# EAGLE design steering_wheel_V3.1 (EAGLE 8.1.0)

## Sheet 1 of 4
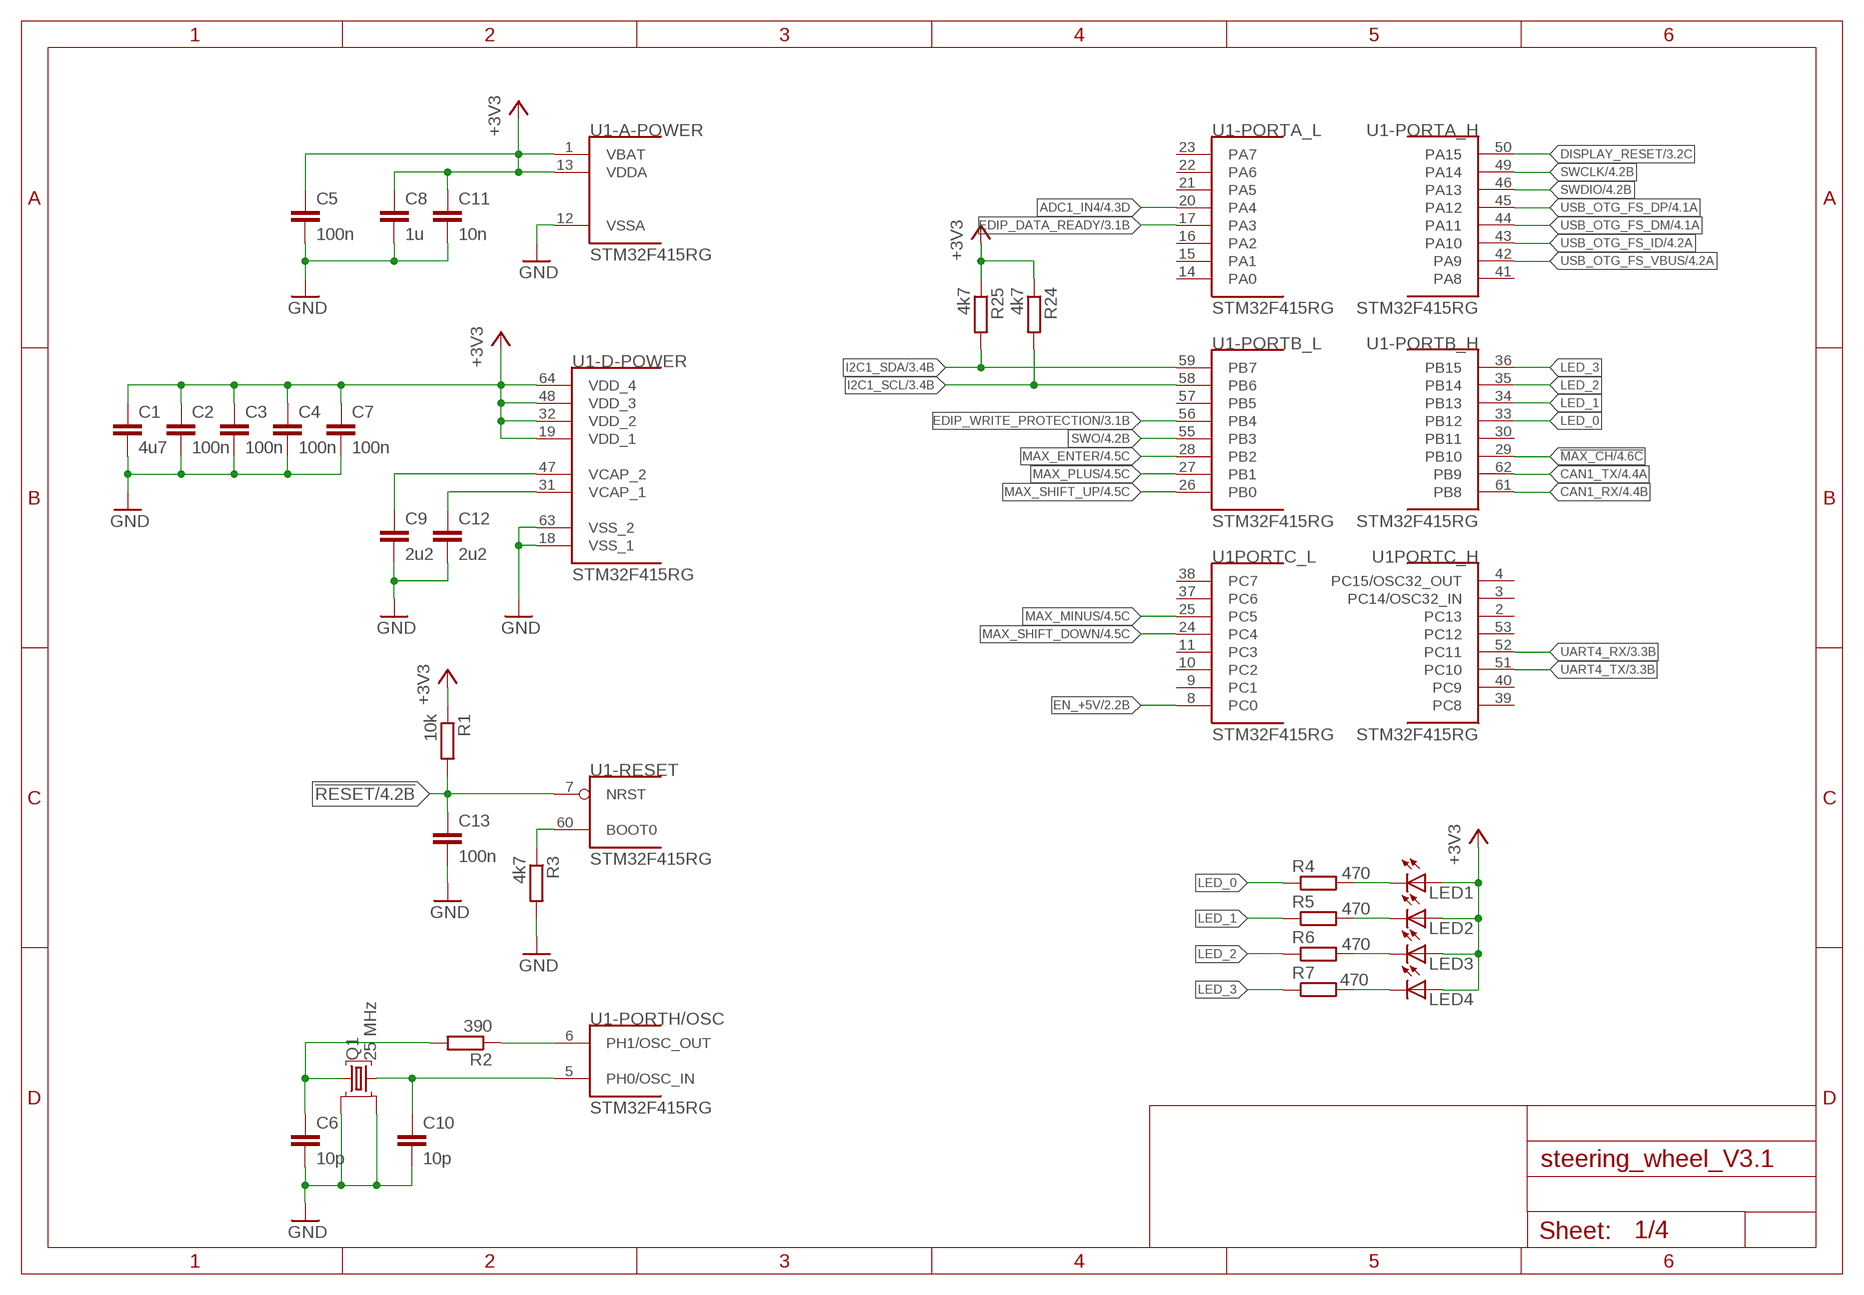
[diagram p0: schematic, sheet 1]

### Parts
C1  4u7  C-EUC0603  [C0603]
C2  100n  C-EUC0603  [C0603]
C3  100n  C-EUC0603  [C0603]
C4  100n  C-EUC0603  [C0603]
C5  100n  C-EUC0603  [C0603]
C6  10p  C-EUC0603  [C0603]
C7  100n  C-EUC0603  [C0603]
C8  1u  C-EUC0603  [C0603]
C9  2u2  C-EUC0603  [C0603]
C10  10p  C-EUC0603  [C0603]
C11  10n  C-EUC0603  [C0603]
C12  2u2  C-EUC0603  [C0603]
C13  100n  C-EUC0603  [C0603]
LED1  LEDCHIPLED_0603  [CHIPLED_0603]
LED2  LEDCHIPLED_0603  [CHIPLED_0603]
LED3  LEDCHIPLED_0603  [CHIPLED_0603]
LED4  LEDCHIPLED_0603  [CHIPLED_0603]
Q1  25 MHz  CRYSTAL2M_CX32  [3.2X2.5MM-SMD]
R1  10k  R-EU_R0603  [R0603]
R2  390  R-EU_R0603  [R0603]
R3  4k7  R-EU_R0603  [R0603]
R4  470  R-EU_R0603  [R0603]
R5  470  R-EU_R0603  [R0603]
R6  470  R-EU_R0603  [R0603]
R7  470  R-EU_R0603  [R0603]
R24  4k7  R-EU_R0603  [R0603]
R25  4k7  R-EU_R0603  [R0603]
U1  STM32F415RG  [LQFP64]

### Nets
!MAX_CH: U1.29(-PORTB_H:PB10) ; also sheet 4
!RESET: C13.1 R1.2 U1.7(-RESET:NRST) ; also sheet 4
+3V3: C1.1 C2.1 C3.1 C4.1 C5.1 C7.1 C8.1 C11.1 LED1.A LED2.A LED3.A LED4.A R1.1 R24.1 R25.1 U1.1(-A-POWER:VBAT) U1.13(-A-POWER:VDDA) U1.19(-D-POWER:VDD_1) U1.32(-D-POWER:VDD_2) U1.48(-D-POWER:VDD_3) U1.64(-D-POWER:VDD_4) ; also sheet 2,3,4
ADC1_IN4: U1.20(-PORTA_L:PA4) ; also sheet 4
CAN1_RX: U1.61(-PORTB_H:PB8) ; also sheet 4
CAN1_TX: U1.62(-PORTB_H:PB9) ; also sheet 4
DISPLAY_RESET: U1.50(-PORTA_H:PA15) ; also sheet 3
EDIP_DATA_READY: U1.17(-PORTA_L:PA3) ; also sheet 3
EDIP_WRITE_PROTECTION: U1.56(-PORTB_L:PB4) ; also sheet 3
EN_+5V: U1.8(PORTC_L:PC0) ; also sheet 2
GND: C1.2 C2.2 C3.2 C4.2 C5.2 C6.2 C7.2 C8.2 C9.2 C10.2 C11.2 C12.2 C13.2 Q1.2(GND1) Q1.4(GND2) R3.2 U1.12(-A-POWER:VSSA) U1.18(-D-POWER:VSS_1) U1.63(-D-POWER:VSS_2) ; also sheet 2,3,4
I2C1_SCL: R24.2 U1.58(-PORTB_L:PB6) ; also sheet 3
I2C1_SDA: R25.2 U1.59(-PORTB_L:PB7) ; also sheet 3
LED_0: R4.1 U1.33(-PORTB_H:PB12)
LED_1: R5.1 U1.34(-PORTB_H:PB13)
LED_2: R6.1 U1.35(-PORTB_H:PB14)
LED_3: R7.1 U1.36(-PORTB_H:PB15)
MAX_ENTER: U1.28(-PORTB_L:PB2) ; also sheet 4
MAX_MINUS: U1.25(PORTC_L:PC5) ; also sheet 4
MAX_PLUS: U1.27(-PORTB_L:PB1) ; also sheet 4
MAX_SHIFT_DOWN: U1.24(PORTC_L:PC4) ; also sheet 4
MAX_SHIFT_UP: U1.26(-PORTB_L:PB0) ; also sheet 4
N$1: C9.1 U1.47(-D-POWER:VCAP_2)
N$2: C12.1 U1.31(-D-POWER:VCAP_1)
N$3: R2.1 U1.6(-PORTH/OSC:PH1/OSC_OUT)
N$4: C10.1 Q1.3(Q2) U1.5(-PORTH/OSC:PH0/OSC_IN)
N$5: LED4.C R7.2
N$6: R3.1 U1.60(-RESET:BOOT0)
N$11: LED2.C R5.2
N$12: LED3.C R6.2
N$24: C6.1 Q1.1(Q1) R2.2
N$27: LED1.C R4.2
SWCLK: U1.49(-PORTA_H:PA14) ; also sheet 4
SWDIO: U1.46(-PORTA_H:PA13) ; also sheet 4
SWO: U1.55(-PORTB_L:PB3) ; also sheet 4
UART4_RX: U1.52(PORTC_H:PC11) ; also sheet 3
UART4_TX: U1.51(PORTC_H:PC10) ; also sheet 3
USB_OTG_FS_DM: U1.44(-PORTA_H:PA11) ; also sheet 4
USB_OTG_FS_DP: U1.45(-PORTA_H:PA12) ; also sheet 4
USB_OTG_FS_ID: U1.43(-PORTA_H:PA10) ; also sheet 4
USB_OTG_FS_VBUS: U1.42(-PORTA_H:PA9) ; also sheet 4
Unconnected: U1.2(PORTC_H:PC13) U1.3(PORTC_H:PC14/OSC32_IN) U1.4(PORTC_H:PC15/OSC32_OUT) U1.9(PORTC_L:PC1) U1.10(PORTC_L:PC2) U1.11(PORTC_L:PC3) U1.14(-PORTA_L:PA0) U1.15(-PORTA_L:PA1) U1.16(-PORTA_L:PA2) U1.21(-PORTA_L:PA5) U1.22(-PORTA_L:PA6) U1.23(-PORTA_L:PA7) U1.30(-PORTB_H:PB11) U1.37(PORTC_L:PC6) U1.38(PORTC_L:PC7) U1.39(PORTC_H:PC8) U1.40(PORTC_H:PC9) U1.41(-PORTA_H:PA8) U1.53(PORTC_H:PC12) U1.54(-PORTD:PD2) U1.57(-PORTB_L:PB5)

## Sheet 2 of 4
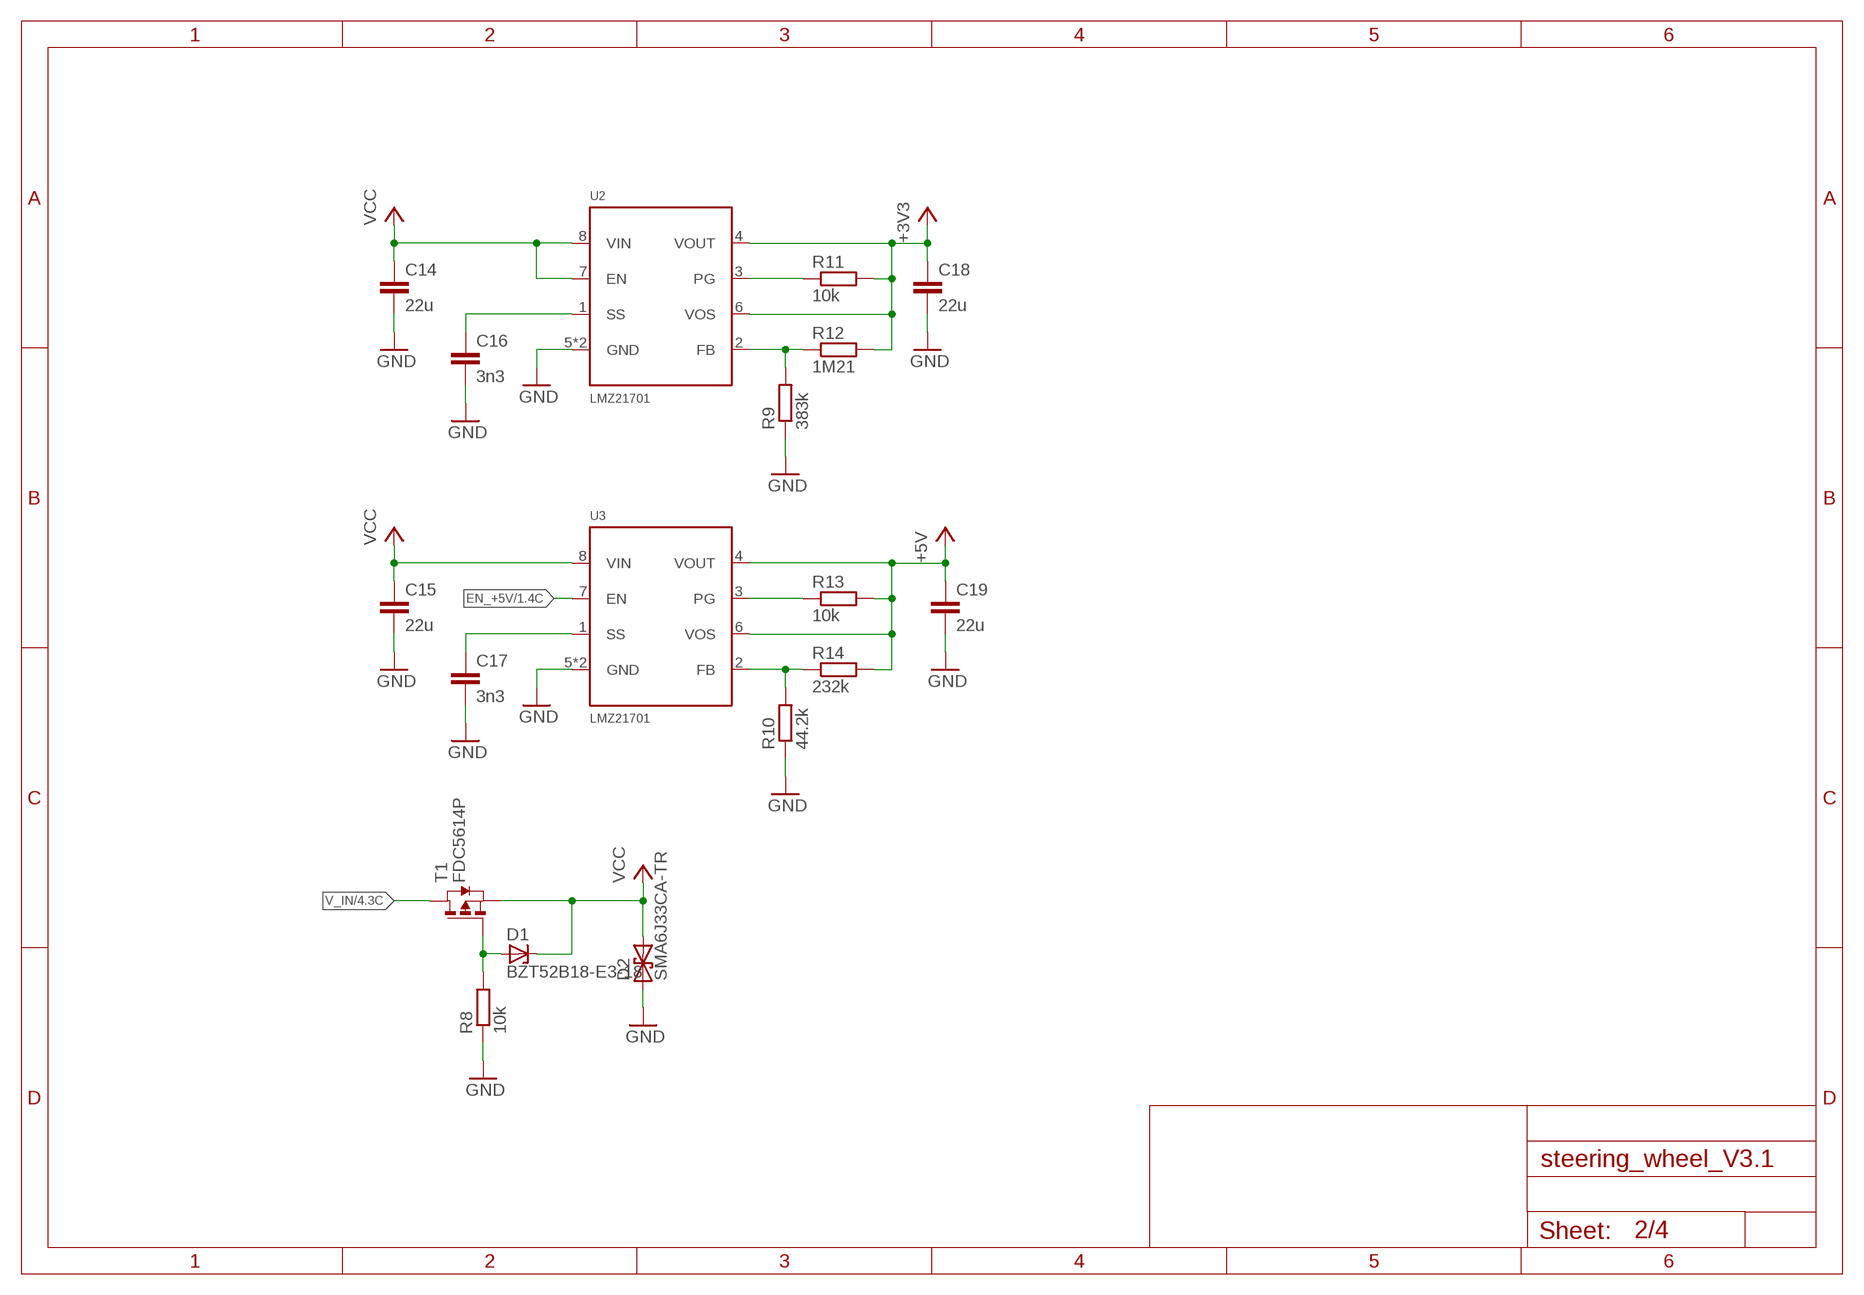
[diagram p1: schematic, sheet 2]

### Parts
C14  22u  C-EUC1210  [C1210]
C15  22u  C-EUC1210  [C1210]
C16  3n3  C-EUC0603  [C0603]
C17  3n3  C-EUC0603  [C0603]
C18  22u  C-EUC1210  [C1210]
C19  22u  C-EUC1210  [C1210]
D1  BZT52B18-E3-18  ZENER_SOD123  [SOD123F]
D2  SMA6J33CA-TR  [DO214AC]
R8  10k  R-EU_R0603  [R0603]
R9  383k  R-EU_R0603  [R0603]
R10  44.2k  R-EU_R0603  [R0603]
R11  10k  R-EU_R0603  [R0603]
R12  1M21  R-EU_R0603  [R0603]
R13  10k  R-EU_R0603  [R0603]
R14  232k  R-EU_R0603  [R0603]
T1  FDC5614P  [SSOT6]
U2  LMZ21701  [SIL0008E]
U3  LMZ21701  [SIL0008E]

### Nets
+3V3: C18.1 R11.2 R12.2 U2.4(VOUT) U2.6(VOS) ; also sheet 1,3,4
+5V: C19.1 R13.2 R14.2 U3.4(VOUT) U3.6(VOS) ; also sheet 4
EN_+5V: U3.7(EN) ; also sheet 1
GND: C14.2 C15.2 C16.2 C17.2 C18.2 C19.2 D2.A R8.1 R9.1 R10.1 U2.5(GND) U2.PAD(GND) U3.5(GND) U3.PAD(GND) ; also sheet 1,3,4
N$14: D1.A R8.2 T1.3(G)
N$38: C16.1 U2.1(SS)
N$39: C17.1 U3.1(SS)
N$40: R13.1 U3.3(PG)
N$41: R11.1 U2.3(PG)
N$42: R9.2 R12.1 U2.2(FB)
N$43: R10.2 R14.1 U3.2(FB)
V_IN: T1.1(D) T1.2(D) T1.5(D) T1.6(D) ; also sheet 4
VCC: C14.1 C15.1 D1.C D2.C T1.4(S) U2.7(EN) U2.8(VIN) U3.8(VIN)

## Sheet 3 of 4
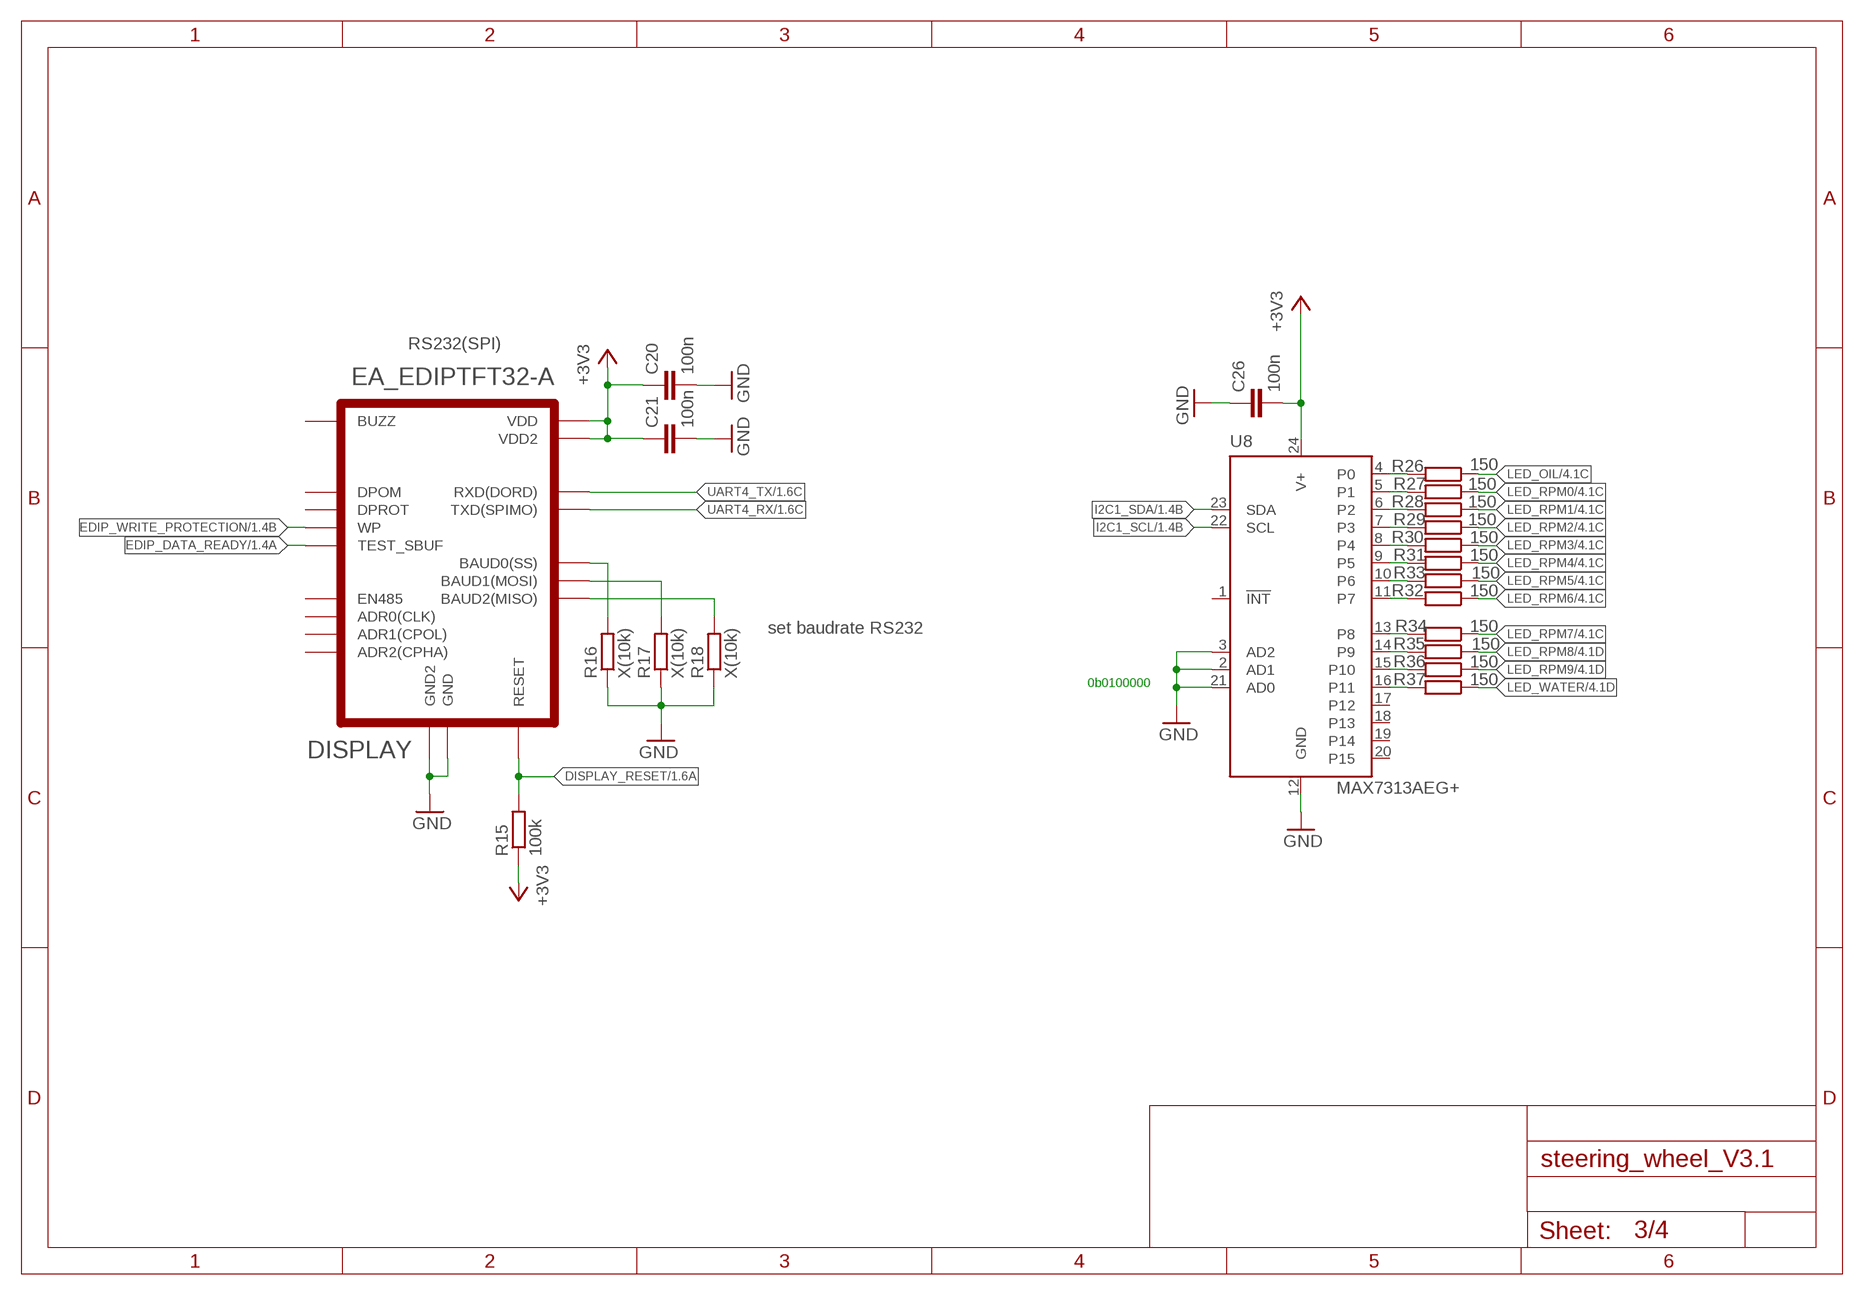
[diagram p2: schematic, sheet 3]

### Parts
C20  100n  C-EUC0603  [C0603]
C21  100n  C-EUC0603  [C0603]
C26  100n  C-EUC0603  [C0603]
DISPLAY  EA_EDIPTFT32-A  EA_EDIPTFT32-A-SR232  [EDIPTFT32-A]
R15  100k  R-EU_R0603  [R0603]
R16  X(10k)  R-EU_R0603  [R0603]
R17  X(10k)  R-EU_R0603  [R0603]
R18  X(10k)  R-EU_R0603  [R0603]
R26  150  R-EU_R0603  [R0603]
R27  150  R-EU_R0603  [R0603]
R28  150  R-EU_R0603  [R0603]
R29  150  R-EU_R0603  [R0603]
R30  150  R-EU_R0603  [R0603]
R31  150  R-EU_R0603  [R0603]
R32  150  R-EU_R0603  [R0603]
R33  150  R-EU_R0603  [R0603]
R34  150  R-EU_R0603  [R0603]
R35  150  R-EU_R0603  [R0603]
R36  150  R-EU_R0603  [R0603]
R37  150  R-EU_R0603  [R0603]
U8  MAX7313AEG+  [QSOP-24]

### Nets
+3V3: C20.1 C21.1 C26.2 DISPLAY.P$2(VDD) DISPLAY.P$22(VDD2) R15.1 U8.24(V+) ; also sheet 1,2,4
DISPLAY_RESET: DISPLAY.P$5(RESET) R15.2 ; also sheet 1
EDIP_DATA_READY: DISPLAY.P$20(TEST_SBUF) ; also sheet 1
EDIP_WRITE_PROTECTION: DISPLAY.P$19(WP) ; also sheet 1
GND: C20.2 C21.2 C26.1 DISPLAY.P$1(GND) DISPLAY.P$21(GND2) R16.1 R17.1 R18.1 U8.2(AD1) U8.3(AD2) U8.12(GND) U8.21(AD0) ; also sheet 1,2,4
I2C1_SCL: U8.22(SCL) ; also sheet 1
I2C1_SDA: U8.23(SDA) ; also sheet 1
LED_OIL: R26.1 ; also sheet 4
LED_RPM0: R27.1 ; also sheet 4
LED_RPM1: R28.1 ; also sheet 4
LED_RPM2: R29.1 ; also sheet 4
LED_RPM3: R30.1 ; also sheet 4
LED_RPM4: R31.1 ; also sheet 4
LED_RPM5: R33.1 ; also sheet 4
LED_RPM6: R32.1 ; also sheet 4
LED_RPM7: R34.1 ; also sheet 4
LED_RPM8: R35.1 ; also sheet 4
LED_RPM9: R36.1 ; also sheet 4
LED_WATER: R37.1 ; also sheet 4
N$7: R26.2 U8.4(P0)
N$8: DISPLAY.P$8(BAUD2(MISO)) R18.2
N$9: R27.2 U8.5(P1)
N$10: DISPLAY.P$7(BAUD1(MOSI)) R17.2
N$13: DISPLAY.P$6(BAUD0(SS)) R16.2
N$15: R28.2 U8.6(P2)
N$16: R29.2 U8.7(P3)
N$17: R30.2 U8.8(P4)
N$18: R31.2 U8.9(P5)
N$19: R32.2 U8.11(P7)
N$20: R33.2 U8.10(P6)
N$21: R34.2 U8.13(P8)
N$22: R35.2 U8.14(P9)
N$23: R36.2 U8.15(P10)
N$25: R37.2 U8.16(P11)
UART4_RX: DISPLAY.P$11(TXD(SPIMO)) ; also sheet 1
UART4_TX: DISPLAY.P$10(RXD(DORD)) ; also sheet 1
Unconnected: DISPLAY.P$9(ADR0(CLK)) DISPLAY.P$12(EN485) DISPLAY.P$13(DPOM) DISPLAY.P$14(ADR1(CPOL)) DISPLAY.P$15(ADR2(CPHA)) DISPLAY.P$16(BUZZ) DISPLAY.P$17(DPROT) U8.1(!INT) U8.17(P12) U8.18(P13) U8.19(P14) U8.20(P15)

### Notes on the sheet
- set baudrate RS232
- 0b0100000

## Sheet 4 of 4
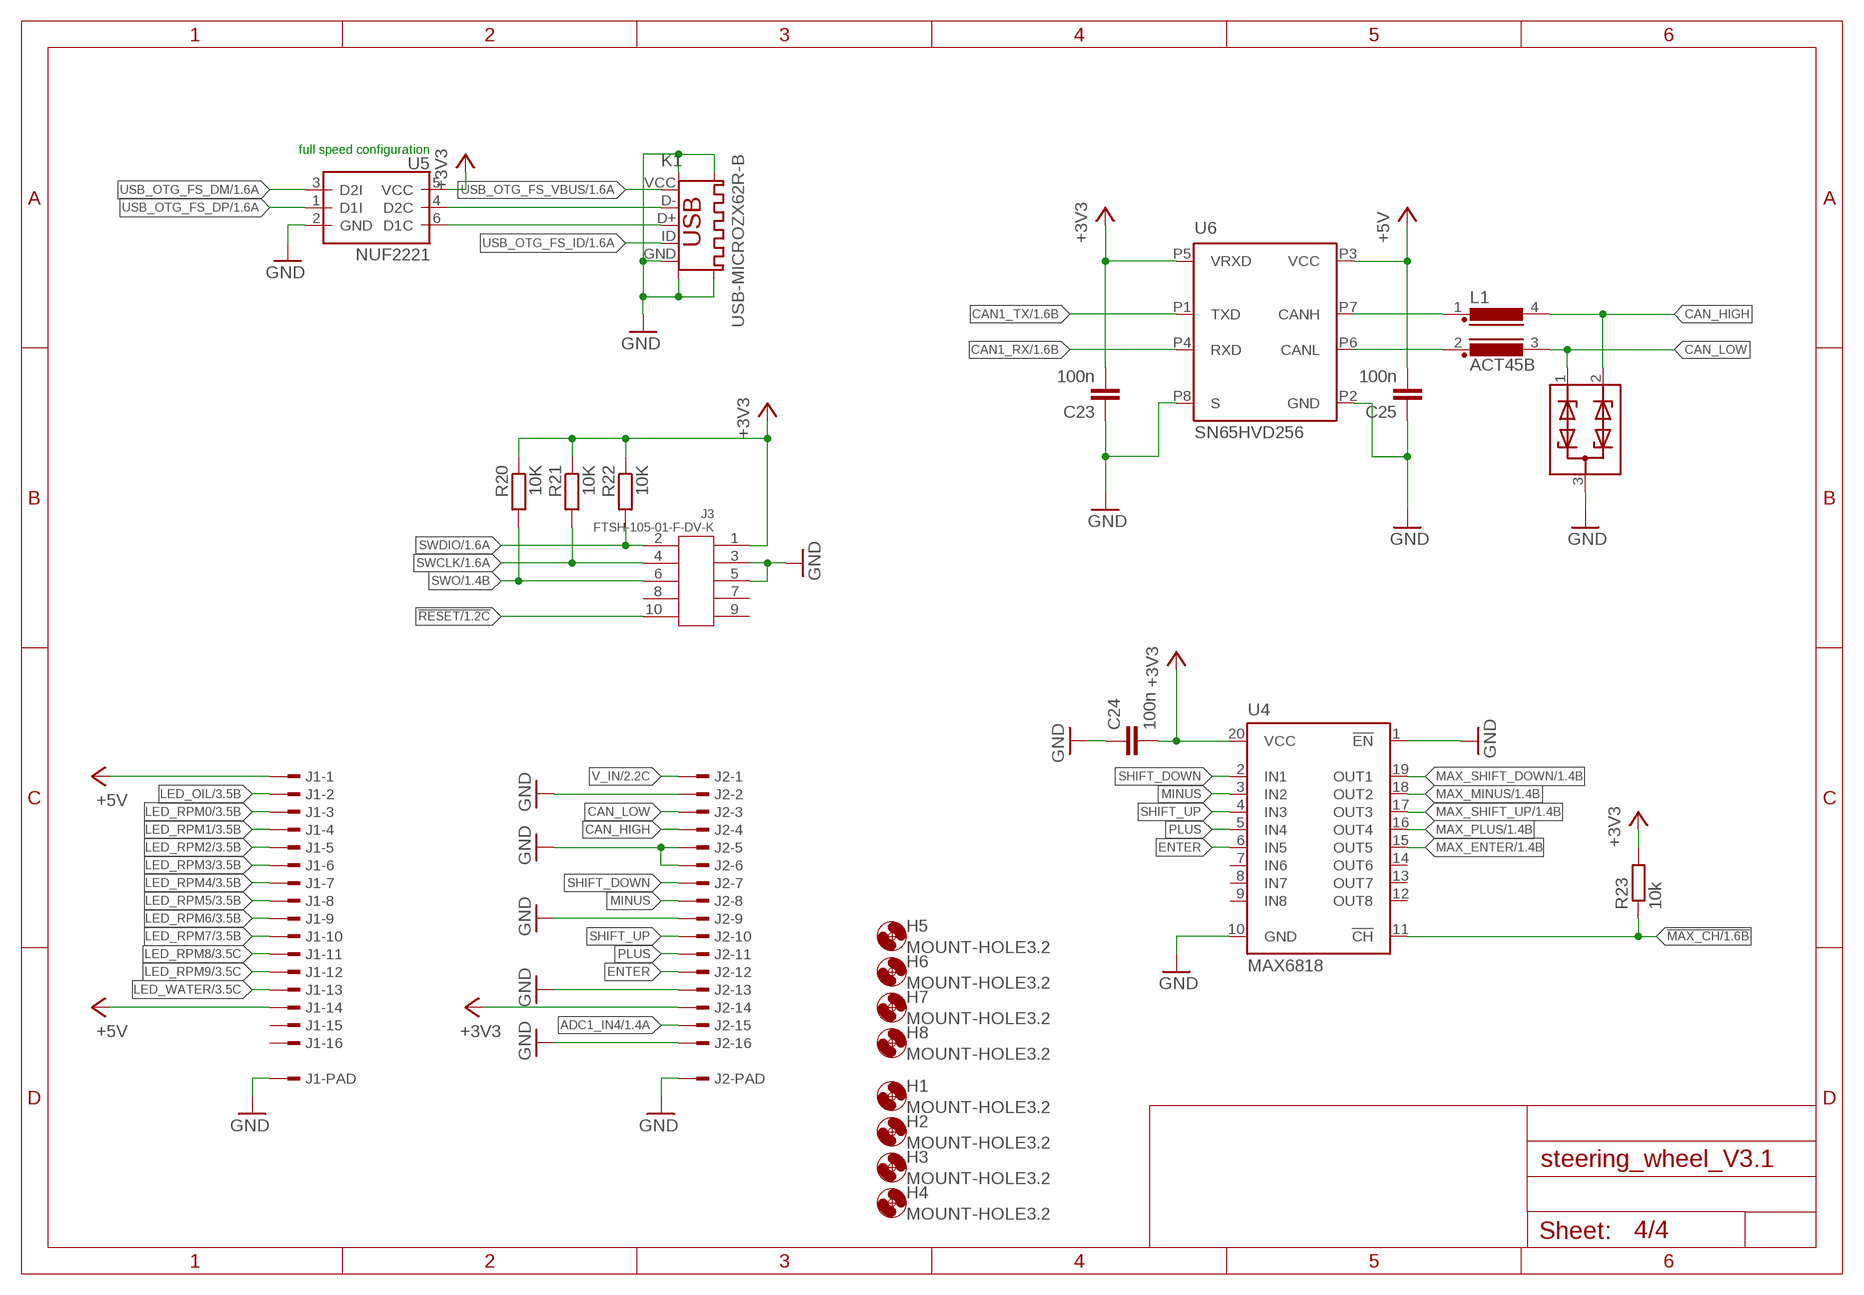
[diagram p3: schematic, sheet 4]

### Parts
C23  100n  C-EUC0603  [C0603]
C24  100n  C-EUC0603  [C0603]
C25  100n  C-EUC0603  [C0603]
D3  PESD1CAN-U  [SOT-323]
H1  MOUNT-HOLE3.2  [3,2]
H2  MOUNT-HOLE3.2  [3,2]
H3  MOUNT-HOLE3.2  [3,2]
H4  MOUNT-HOLE3.2  [3,2]
H5  MOUNT-HOLE3.2  [3,2]
H6  MOUNT-HOLE3.2  [3,2]
H7  MOUNT-HOLE3.2  [3,2]
H8  MOUNT-HOLE3.2  [3,2]
J1  1-292227-6  [1-292227-6]
J2  1-292227-6  [1-292227-6]
J3  FTSH-105-01-F-DV-K  [FTSH-105-01-XXX-DV-K]
K1  USB-MICROZX62R-B  [ZX62R-B]
L1  ACT45B  [ACT45B]
R20  10K  R-EU_R0603  [R0603]
R21  10K  R-EU_R0603  [R0603]
R22  10K  R-EU_R0603  [R0603]
R23  10k  R-EU_R0603  [R0603]
U4  MAX6818  [SSOP-20]
U5  NUF2221  [SOT363]
U6  SN65HVD256  [SOIC8]

### Nets
!MAX_CH: R23.1 U4.11(!CH) ; also sheet 1
!RESET: J3.10 ; also sheet 1
+3V3: C23.2 C24.2 J2.14 J3.1 R20.1 R21.1 R22.1 R23.2 U4.20(VCC) U5.5(VCC) U6.P5(VRXD) ; also sheet 1,2,3
+5V: C25.2 J1.1 J1.14 U6.P3(VCC) ; also sheet 2
ADC1_IN4: J2.15 ; also sheet 1
CAN1_RX: U6.P4(RXD) ; also sheet 1
CAN1_TX: U6.P1(TXD) ; also sheet 1
CAN_HIGH: D3.2 J2.4 L1.4
CAN_LOW: D3.1 J2.3 L1.3
ENTER: J2.12 U4.6(IN5)
GND: C23.1 C24.1 C25.1 D3.3 J1.PAD1 J1.PAD2 J2.2 J2.5 J2.6 J2.9 J2.13 J2.16 J2.PAD1 J2.PAD2 J3.3 J3.5 K1.GND K1.P$6(GND3) K1.P$7(GND4) K1.P$8(GND1) K1.P$9(GND2) U4.1(!EN) U4.10(GND) U5.2(GND) U6.P2(GND) U6.P8(S) ; also sheet 1,2,3
LED_OIL: J1.2 ; also sheet 3
LED_RPM0: J1.3 ; also sheet 3
LED_RPM1: J1.4 ; also sheet 3
LED_RPM2: J1.5 ; also sheet 3
LED_RPM3: J1.6 ; also sheet 3
LED_RPM4: J1.7 ; also sheet 3
LED_RPM5: J1.8 ; also sheet 3
LED_RPM6: J1.9 ; also sheet 3
LED_RPM7: J1.10 ; also sheet 3
LED_RPM8: J1.11 ; also sheet 3
LED_RPM9: J1.12 ; also sheet 3
LED_WATER: J1.13 ; also sheet 3
MAX_ENTER: U4.15(OUT5) ; also sheet 1
MAX_MINUS: U4.18(OUT2) ; also sheet 1
MAX_PLUS: U4.16(OUT4) ; also sheet 1
MAX_SHIFT_DOWN: U4.19(OUT1) ; also sheet 1
MAX_SHIFT_UP: U4.17(OUT3) ; also sheet 1
MINUS: J2.8 U4.3(IN2)
N$47: L1.1 U6.P7(CANH)
N$66: L1.2 U6.P6(CANL)
PLUS: J2.11 U4.5(IN4)
SHIFT_DOWN: J2.7 U4.2(IN1)
SHIFT_UP: J2.10 U4.4(IN3)
SWCLK: J3.4 R21.2 ; also sheet 1
SWDIO: J3.2 R22.2 ; also sheet 1
SWO: J3.6 R20.2 ; also sheet 1
USB_DM: K1.D- U5.4(D2C)
USB_DP: K1.D+ U5.6(D1C)
USB_OTG_FS_DM: U5.3(D2I) ; also sheet 1
USB_OTG_FS_DP: U5.1(D1I) ; also sheet 1
USB_OTG_FS_ID: K1.ID ; also sheet 1
USB_OTG_FS_VBUS: K1.VCC ; also sheet 1
V_IN: J2.1 ; also sheet 2
Unconnected: J1.15 J1.16 J3.7 J3.8 J3.9 U4.7(IN6) U4.8(IN7) U4.9(IN8) U4.12(OUT8) U4.13(OUT7) U4.14(OUT6)

### Notes on the sheet
- full speed configuration

## Library data of the parts
C1-C5 C7-C9 C11 C12 C14-C21 C23-C26 = rcl:C-EU: CAPACITOR, European symbol
C6 C10 C13 = rcl:C-EU: CAPACITOR, European symbol; DISTRIBUTOR: Digikey; OC_DIGIKEY: 445-1769-1-ND; ORDER_CODE: 445-1769-1-ND
D1 = usr_diode:ZENER_SOD123; DISTRIBUTOR: Mouser; OC_MOUSER: 78-BZT52B18-E3-18; ORDER_CODE: 78-BZT52B18-E3-18
D2 = usr_diode:SMA6J33CA-TR; DISTRIBUTOR: Mouser; OC_MOUSER: 511-SMA6J33CA-TR; ORDER_CODE: 511-SMA6J33CA-TR
D3 = usr_nxp:PESD1CAN-U: PESD1CAN-U CAN bus ESD protection diode; DISTRIBUTOR: Digikey; OC_DIGIKEY: 568-10731-1-ND; ORDER_CODE: 568-10731-1-ND
DISPLAY = _TUG Racing Team_:EA_EDIPTFT32-A-SR232
H1-H8 = holes:MOUNT-HOLE: MOUNTING HOLE with drill center marker
J1 J2 = te:1-292227-6: 1.5mm AMP Mini CT Connectors; DISTRIBUTOR: Digikey; OC_DIGIKEY: A99782CT-ND; ORDER_CODE: A99782CT-ND
J3 = samtec:FTSH-105-01-*-DV-K
K1 = usr_hirose-electric:USB-MICRO: Micro B - Reverse (Top mount) Shell SMT Source: http://media.digikey.com/PDF/Data%20Sheets/Hirose%20PDFs/ZX62R-B-5P.pdf; DISTRIBUTOR: Digikey; OC_DIGIKEY: H11574CT-ND; ORDER_CODE: H11574CT-ND
L1 = usr_gerneral:ACT45B: EPCOS - ACT45B common-mode chokes for CAN bus systems, EIA 1812 51 μH, 200 mA; DISTRIBUTOR: Digikey; OC_DIGIKEY: 495-4597-2-ND; ORDER_CODE: 495-4597-2-ND
LED1-LED4 = led:LED: LED OSRAM: - CHIPLED LG R971, LG N971, LY N971, LG Q971, LY Q971, LO R971, LY R971 LH N974, LH R974 LS Q976, LO Q976, LY Q976 LO Q996 - Hyper CHIPLED LW Q18S LB Q993, LB Q99A, LB R99A - SideLED LS A670, LO A670, LY A670, LG A670, LP A670 LB A673, LV A673, LT A673, LW A673 LH A674 LY A675 LS A676, LA A676, LO A676, LY A676, LW A676 LS A679, LY A679, LG A679 - Hyper Micro SIDELED® LS Y876, LA Y876, LO Y876, LY Y876 LT Y87S - SmartLED LW L88C, LW L88S LB L89C, LB L89S, LG L890 LS L89K, LO L89K, LY L89K LS L896, LA L896, LO L896, LY L896 - TOPLED LS T670, LO T670, LY T670, LG T670, LP T670 LSG T670, LSP T670, LSY T670, LOP T670, LYG T670 LG T671, LOG T671, LSG T671 LB T673, LV T673, LT T673, LW T673 LH T674 LS T676, LA T676, LO T676, LY T676, LB T676, LH T676, LSB T676, LW T676 LB T67C, LV T67C, LT T67C, LS T67K, LO T67K, LY T67K, LW E67C LS E67B, LA E67B, LO E67B, LY E67B, LB E67C, LV E67C, LT E67C LW T67C LS T679, LY T679, LG T679 LS T770, LO T770, LY T770, LG T770, LP T770 LB T773, LV T773, LT T773, LW T773 LH T774 LS E675, LA E675, LY E675, LS T675 LS T776, LA T776, LO T776, LY T776, LB T776 LHGB T686 LT T68C, LB T68C - Hyper Mini TOPLED® LB M676 - Mini TOPLED Santana® LG M470 LS M47K, LO M47K, LY M47K Source: http://www.osram.convergy.de LUXEON: - LUMILED® LXK2-PW12-R00, LXK2-PW12-S00, LXK2-PW14-U00, LXK2-PW14-V00 LXK2-PM12-R00, LXK2-PM12-S00, LXK2-PM14-U00 LXK2-PE12-Q00, LXK2-PE12-R00, LXK2-PE12-S00, LXK2-PE14-T00, LXK2-PE14-U00 LXK2-PB12-K00, LXK2-PB12-L00, LXK2-PB12-M00, LXK2-PB14-N00, LXK2-PB14-P00, LXK2-PB14-Q00 LXK2-PR12-L00, LXK2-PR12-M00, LXK2-PR14-Q00, LXK2-PR14-R00 LXK2-PD12-Q00, LXK2-PD12-R00, LXK2-PD12-S00 LXK2-PH12-R00, LXK2-PH12-S00 LXK2-PL12-P00, LXK2-PL12-Q00, LXK2-PL12-R00 Source: www.luxeon.com KINGBRIGHT: KA-3528ASYC Source: www.kingbright.com; ASMT-RA45-AQ502: amber; ASMT-RF45-AQ502: green; ASMT-RJ45-AQ502: orange; ASMT-RR45-AQ502: red
Q1 = usr_crystal:CRYSTAL2M*: Crystal Source: ABM11 Series <http://www.abracon.com/Resonators/ABM11.pdf>; DISTRIBUTOR: Digikey; OC_DIGIKEY: 644-1266-1-ND; ORDER_CODE: 644-1266-1-ND
R1-R3 R9 R11-R13 R24-R37 = rcl:R-EU_: RESISTOR, European symbol; DISTRIBUTOR: Digikey; OC_DIGIKEY: P390AGCT-ND; ORDER_CODE: P390AGCT-ND
R4-R7 R10 R14-R18 R23 = rcl:R-EU_: RESISTOR, European symbol
R8 R20-R22 = rcl:R-EU_: RESISTOR, European symbol; DISTRIBUTOR: Mouser; OC_MOUSER: 71-CRCW0402-10K-E3; ORDER_CODE: 71-CRCW0402-10K-E3
T1 = usr_gerneral:FDC5614P: 60V P-Channel MOSFET Id -3A Vds -60V Vgs -20V; DISTRIBUTOR: Mouser; OC_MOUSER: 512-FDC5614P; ORDER_CODE: 512-FDC5614P
U1 = STMicroelectronics:STM32F415RG; DISTRIBUTOR: Digikey; OC_DIGIKEY: 497-11767-ND; ORDER_CODE: 497-11767-ND
U2 U3 = ti:LMZ2170*: LMZ2170X 1 A SIMPLE SWITCHER® Nano Module with 17 V Maximum Input Voltage; DISTRIBUTOR: RS; ORDER_CODE: 798-1212
U4 = maxim:MAX6818: ±15kV ESD-Protected Octal CMOS Switch Debouncers
U5 = usr_on-semiconductor:NUF2221: USB Upstream Terminator with ESD Protection http://www.onsemi.com/pub_link/Collateral/NUF2221W1T2-D.PDF; DISTRIBUTOR: Digikey; OC_DIGIKEY: NUF2221W1T2GOSCT-ND; ORDER_CODE: NUF2221W1T2GOSCT-ND
U6 = usr_TexasInstruments:SN65HVD256: SN65HVD256 - CAN Transceiver With Fast Loop Times for Highly Loaded Networks has logic and output power supplies!; DISTRIBUTOR: Digikey; OC_DIGIKEY: 296-30093-1-ND; ORDER_CODE: 296-30093-1-ND
U8 = maxim:MAX7313: 16-Port I/O Expander with LED Intensity Control, Interrupt, and Hot-Insertion Protection

## Board
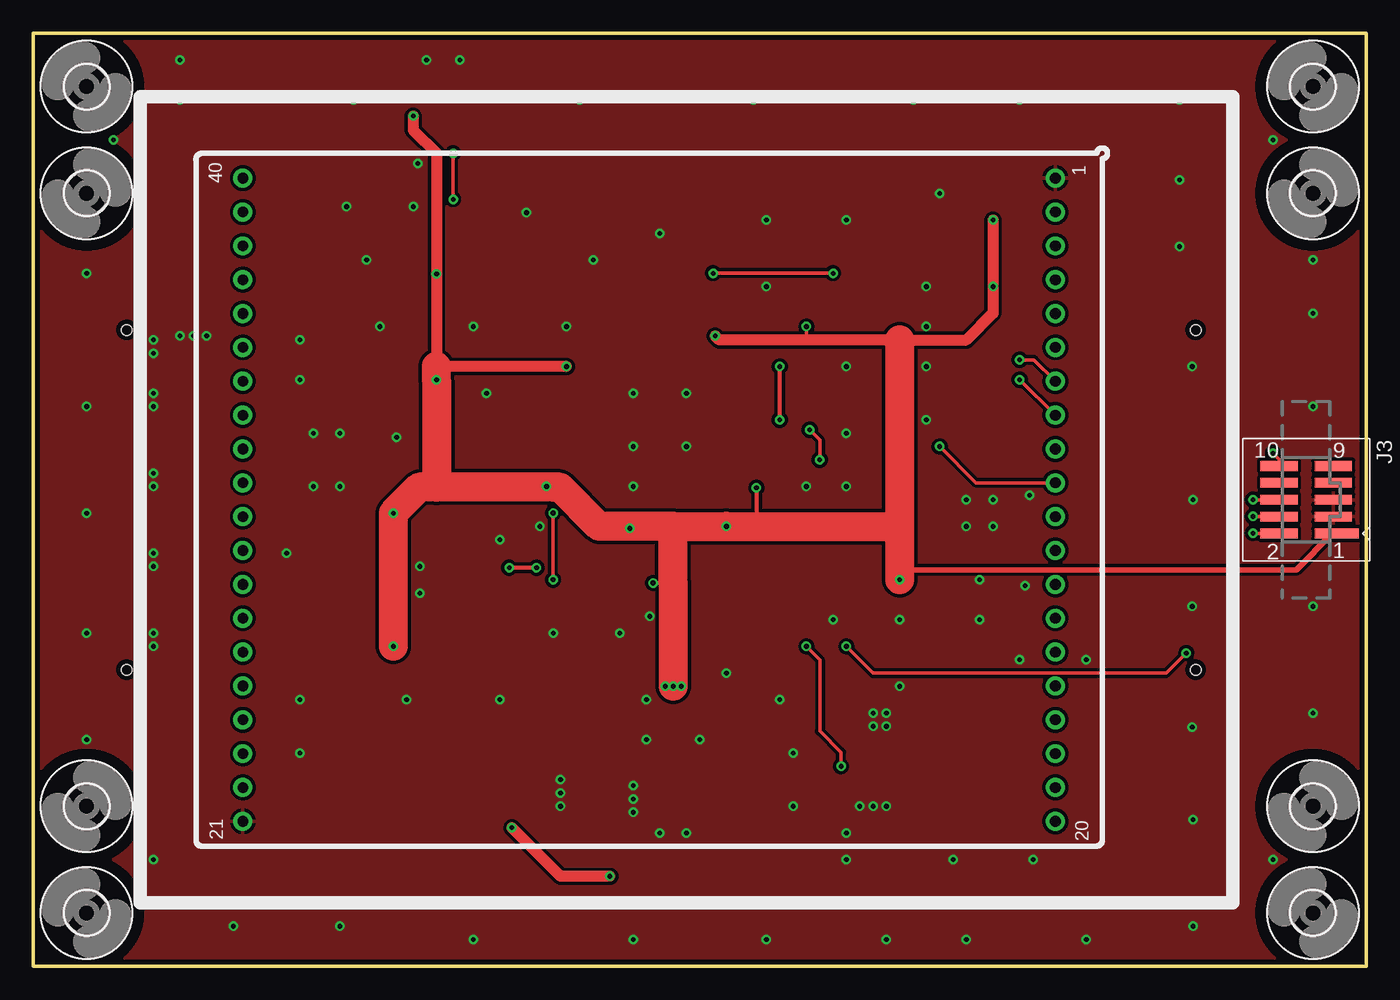
[diagram p4: board, top side]
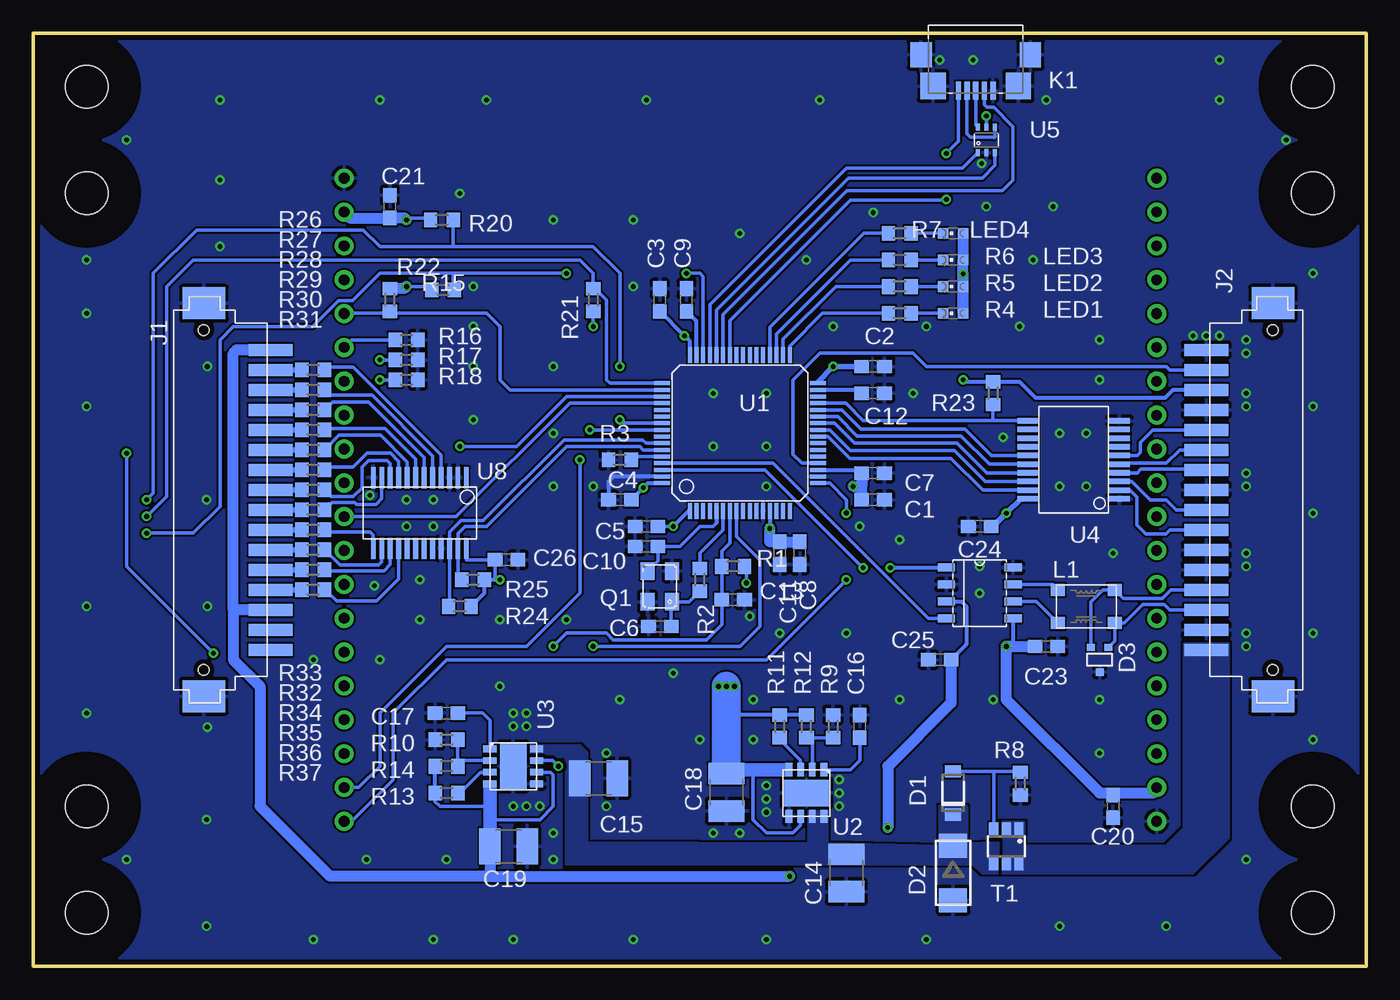
[diagram p5: board, bottom side, seen from below]

Size 100 x 70 mm. Coordinates in mm from the lower left corner, seen from the top.
Outline: 0,70 0,0 100,0 100,70 0,70
Copper layers (1*16): Top 0.0356mm / dielectric 1.5011mm / Bottom 0.0356mm
Design rules "oshPark2Layer": minimum track width 6mil, minimum drill 13mil, track to track 6mil, track to pad 6mil, pad to pad 6mil, via to via 6mil, smd to smd 6mil, copper to edge 15mil, drill to drill 6mil, minimum pad ring 7mil, minimum via ring 7mil, stop-mask expansion 3mil, vias tented up to drill 0mil, thermal gap 10mil
tKeepout: area 9,6 to 89,64

### Footprints (pad centres in the part's own frame; a part is rotated, then mirrored left to right if it is on the bottom)
C0603 = smd 1.1 x 1: 1 -0.85,0; 2 0.85,0
C1210 = smd 1.6 x 2.7: 1 -1.4,0; 2 1.4,0
SOD123F = smd 0.91 x 1.22: A 1.625,0; C -1.625,0
DO214AC = smd 1.8 x 2.1: A 2.05,0; C -2.05,0
SOT-323 = smd 0.6 x 0.55: 1 -0.65,-0.925; 2 0.65,-0.925; 3 0,0.925
EDIPTFT32-A = drill 0.8 pad 1.422: P$1 -24.13,30.48; P$2 -21.59,30.48; P$3 -19.05,30.48; P$4 -16.51,30.48; P$5 -13.97,30.48; P$6 -11.43,30.48; P$7 -8.89,30.48; P$8 -6.35,30.48; P$9 -3.81,30.48; P$10 -1.27,30.48; P$11 1.27,30.48; P$12 3.81,30.48; P$13 6.35,30.48; P$14 8.89,30.48; P$15 11.43,30.48; P$16 13.97,30.48; P$17 16.51,30.48; P$18 19.05,30.48; P$19 21.59,30.48; P$20 24.13,30.48; P$21 24.13,-30.48; P$22 21.59,-30.48; P$23 19.05,-30.48; P$24 16.51,-30.48; P$25 13.97,-30.48; P$26 11.43,-30.48; P$27 8.89,-30.48; P$28 6.35,-30.48; P$29 3.81,-30.48; P$30 1.27,-30.48; P$31 -1.27,-30.48; P$32 -3.81,-30.48; P$33 -6.35,-30.48; P$34 -8.89,-30.48; P$35 -11.43,-30.48; P$36 -13.97,-30.48; P$37 -16.51,-30.48; P$38 -19.05,-30.48; P$39 -21.59,-30.48; P$40 -24.13,-30.48
3,2 = hole 3.2: 0,0
1-292227-6 = smd 0.9 x 3.3: 1 -11.25,5; 2 -9.75,5; 3 -8.25,5; 4 -6.75,5; 5 -5.25,5; 6 -3.75,5; 7 -2.25,5; 8 -0.75,5; 9 0.75,5; 10 2.25,5; 11 3.75,5; 12 5.25,5; 13 6.75,5; 14 8.25,5; 15 9.75,5; 16 11.25,5 | smd 2.4 x 3.2: PAD1 -14.75,0; PAD2 14.75,0 | hole 0.8: 12.75,0; -12.75,0
FTSH-105-01-XXX-DV-K = smd 0.737 x 3.302: 1 2.54,2.286 | smd 0.737 x 2.794: 2 2.54,-2.032; 3 1.27,2.032; 4 1.27,-2.032; 5 0,2.032; 6 0,-2.032; 7 -1.27,2.032; 8 -1.27,-2.032; 9 -2.54,2.032; 10 -2.54,-2.032
ZX62R-B = smd 1.35 x 0.4: D+ 2.35,0; D- 2.35,-0.65; GND 2.35,1.3; ID 2.35,0.65; VCC 2.35,-1.3 | smd 2 x 1.9: P$6 2,-3.2; P$8 2,3.2 | smd 1.9 x 1.6: P$7 -0.35,-4.1; P$9 -0.35,4.1
ACT45B = smd 1.05 x 0.9: 1 -2.125,1.25; 2 -2.125,-1.25; 3 2.125,-1.25; 4 2.125,1.25
CHIPLED_0603 = smd 0.8 x 0.8: A 0,-0.75; C 0,0.75
3.2X2.5MM-SMD = smd 1.3 x 1.05: 1 1.15,0.925; 2 -1.15,0.925; 3 -1.15,-0.925; 4 1.15,-0.925
R0603 = smd 1 x 1.1: 1 -0.85,0; 2 0.85,0
SSOT6 = smd 0.69 x 0.99: 1 -0.95,-1.3; 2 0,-1.3; 3 0.95,-1.3; 4 0.95,1.3; 5 0,1.3; 6 -0.95,1.3
LQFP64 = smd 1.2 x 0.3: 1 -5.85,3.75; 2 -5.85,3.25; 3 -5.85,2.75; 4 -5.85,2.25; 5 -5.85,1.75; 6 -5.85,1.25; 7 -5.85,0.75; 8 -5.85,0.25; 9 -5.85,-0.25; 10 -5.85,-0.75; 11 -5.85,-1.25; 12 -5.85,-1.75; 13 -5.85,-2.25; 14 -5.85,-2.75; 15 -5.85,-3.25; 16 -5.85,-3.75; 33 5.85,-3.75; 34 5.85,-3.25; 35 5.85,-2.75; 36 5.85,-2.25; 37 5.85,-1.75; 38 5.85,-1.25; 39 5.85,-0.75; 40 5.85,-0.25; 41 5.85,0.25; 42 5.85,0.75; 43 5.85,1.25; 44 5.85,1.75; 45 5.85,2.25; 46 5.85,2.75; 47 5.85,3.25; 48 5.85,3.75 | smd 0.3 x 1.2: 17 -3.75,-5.85; 18 -3.25,-5.85; 19 -2.75,-5.85; 20 -2.25,-5.85; 21 -1.75,-5.85; 22 -1.25,-5.85; 23 -0.75,-5.85; 24 -0.25,-5.85; 25 0.25,-5.85; 26 0.75,-5.85; 27 1.25,-5.85; 28 1.75,-5.85; 29 2.25,-5.85; 30 2.75,-5.85; 31 3.25,-5.85; 32 3.75,-5.85; 49 3.75,5.85; 50 3.25,5.85; 51 2.75,5.85; 52 2.25,5.85; 53 1.75,5.85; 54 1.25,5.85; 55 0.75,5.85; 56 0.25,5.85; 57 -0.25,5.85; 58 -0.75,5.85; 59 -1.25,5.85; 60 -1.75,5.85; 61 -2.25,5.85; 62 -2.75,5.85; 63 -3.25,5.85; 64 -3.75,5.85
SIL0008E = smd 1 x 0.5: 1 -1.75,1.312; 2 -1.75,0.438; 3 -1.75,-0.438; 4 -1.75,-1.312; 5 1.75,-1.312; 6 1.75,-0.438; 7 1.75,0.438; 8 1.75,1.312 | smd 2 x 3.5: PAD 0,0
SSOP-20 = smd 0.42 x 1.62: 1 -2.925,-3.425; 2 -2.275,-3.425; 3 -1.625,-3.425; 4 -0.975,-3.425; 5 -0.325,-3.425; 6 0.325,-3.425; 7 0.975,-3.425; 8 1.625,-3.425; 9 2.275,-3.425; 10 2.925,-3.425; 11 2.925,3.425; 12 2.275,3.425; 13 1.625,3.425; 14 0.975,3.425; 15 0.325,3.425; 16 -0.325,3.425; 17 -0.975,3.425; 18 -1.625,3.425; 19 -2.275,3.425; 20 -2.925,3.425
SOT363 = smd 0.3 x 0.5: 1 0.65,0.95; 2 0,0.95; 3 -0.65,0.95; 4 -0.65,-0.95; 5 0,-0.95; 6 0.65,-0.95
SOIC8 = smd 0.6 x 1.3: P1 -1.905,-2.5; P2 -0.635,-2.5; P3 0.635,-2.5; P4 1.905,-2.5; P5 1.905,2.5; P6 0.635,2.5; P7 -0.635,2.5; P8 -1.905,2.5
QSOP-24 = smd 0.36 x 1.6: 1 -3.493,-2.655; 2 -2.857,-2.655; 3 -2.223,-2.655; 4 -1.587,-2.655; 5 -0.953,-2.655; 6 -0.318,-2.655; 7 0.318,-2.655; 8 0.953,-2.655; 9 1.587,-2.655; 10 2.223,-2.655; 11 2.857,-2.655; 12 3.493,-2.655; 13 3.493,2.655; 14 2.857,2.655; 15 2.223,2.655; 16 1.587,2.655; 17 0.953,2.655; 18 0.318,2.655; 19 -0.318,2.655; 20 -0.953,2.655; 21 -1.587,2.655; 22 -2.223,2.655; 23 -2.857,2.655; 24 -3.493,2.655

### Placement (x,y rotation side)
C1  37,35 0 bottom
C2  37,45 0 bottom
C3  53,50 90 bottom
C4  56,35 180 bottom
C5  54,33 180 bottom
C6  53,25.5 180 bottom
C7  37,37 0 bottom
C8  42.5,31 270 bottom
C9  51,50 90 bottom
C10  54,31.5 180 bottom
C11  44,31 270 bottom
C12  37,43 0 bottom
C13  47.5,27.5 0 bottom
C14  39,7 270 bottom
C15  57.6,14.1 0 bottom
C16  38,18 90 bottom
C17  69,19 180 bottom
C18  48,13.05 270 bottom
C19  64.35,9 0 bottom
C20  19,12 270 bottom
C21  73.25,57 90 bottom
C23  24,24 180 bottom
C24  29,33 0 bottom
C25  32,23 0 bottom
C26  64.5,30.5 180 bottom
D1  31,13 90 bottom
D2  31,7 270 bottom
D3  20,23 180 bottom
DISPLAY  46.2,35 270 top
H1  4,66 270 top
H2  4,4 270 top
H3  96,66 270 top
H4  96,4 270 top
H5  4,58 0 top
H6  4,12 0 top
H7  96,58 0 top
H8  96,12 0 top
J1  87.2,35 270 bottom
J2  7,35 90 bottom
J3  95.5,35 270 top
K1  29.3,68.05 270 bottom
L1  21,27 0 bottom
LED1  31,49 90 bottom
LED2  31,51 90 bottom
LED3  31,53 90 bottom
LED4  31,55 90 bottom
Q1  53,28.5 270 bottom
R1  47.5,30 180 bottom
R2  50,29 270 bottom
R3  56,38 180 bottom
R4  35,49 0 bottom
R5  35,51 0 bottom
R6  35,53 0 bottom
R7  35,55 0 bottom
R8  25.95,13.7 90 bottom
R9  40,18 270 bottom
R10  69,17 0 bottom
R11  44,18 90 bottom
R12  42,18 90 bottom
R13  69,13 180 bottom
R14  69,15 180 bottom
R15  73.25,50 270 bottom
R16  72,47 180 bottom
R17  72,45.5 180 bottom
R18  72,44 180 bottom
R20  69.35,56 0 bottom
R21  58,50 90 bottom
R22  69.25,50.75 0 bottom
R23  28,43 90 bottom
R24  68,27 180 bottom
R25  67,29 180 bottom
R26  79,44.75 0 bottom
R27  79,43.25 0 bottom
R28  79,41.75 0 bottom
R29  79,40.25 0 bottom
R30  79,38.75 0 bottom
R31  79,37.25 0 bottom
R32  79,34.25 0 bottom
R33  79,35.75 0 bottom
R34  79,32.75 0 bottom
R35  79,31.25 0 bottom
R36  79,29.75 0 bottom
R37  79,28.25 0 bottom
T1  27,9 180 bottom
U1  47,40 90 bottom
U2  42,13 270 bottom
U3  64,15 0 bottom
U4  21.95,38 90 bottom
U5  28.5,62 180 bottom
U6  29,28 270 bottom
U8  71,34 180 bottom

### Tracks (layer width: path | path; a pad name or v marks a point on that pad's centre or on a via)
!MAX_CH
  Bottom 0.254: U1.29 39.05,42.25 37.75,40.95 28,40.95 | 28,40.95 26.65,40.95 25.4,40.95 U4.11 | R23.1 28,40.95
!RESET  (via drill 0.35)
  Top 0.254: v61,24 63,22 76.25,22 76.27,22.02 77.09,22.02 77.11,22 85,22 v86.5,23.5 | v93,38.5 93.47,38.03 J3.10
  Bottom 0.254: U1.7 47.75,31.75 48.35,31.15 C13.1 R1.2 48.35,25.65 49.5,24.5 56.5,24.5 57,25 60,25 v61,24 60.25,24.75 | v86.5,23.5 93,30 v93,38.5
+3V3  (via drill 0.35, 0.36)
  Top 0.254: v58,48 58,47 | v46.5,28.75 48,28.75
  Top 0.305: v54.25,35.9 54.25,33 v52,33 | 42.45,33 42.45,32.85 v44.75,32.85
  Top 0.406: J3.1 97.46,32.46 94.75,29.75 65.75,29.75 v65,29
  Top 0.813: v40,45 30.25,45 v30.25,51.95 30.25,61 28.5,62.75 v28.5,63.8 | v38.5,36 39,36 39,35.95 | v72,56 v72,51 72,49 70,47 65,47 58,47 51.45,47 v51.15,47.3
  Top 2.184: 48,33 48,28.75 v48,21 | 30.25,45 v30.25,44 30.25,35.95 | 30.25,35.95 39,35.95 39.5,35.95 42.45,33 48,33 | 30.25,35.95 28.95,35.95 v27,34 v27,24 | 48,33 v52,33 65,33 | v65,29 65,33 | 65,33 65,47
  Bottom 0.254: U2.6 42.44,10.56 43,10 45,10 46,11 46,14.75 | U5.5 v28.5,63.8 | 39.9,45 v40,45 | C24.2 28,33 | 26.09,26.09 26,26 | C5.1 v52,33 | 72.15,56.15 70.2,56.15 R20.1 | C3.1 53,49.05 | 72,50.75 v72,51 70.1,51 R22.1 | R1.1 46.5,29.85 v46.5,28.75 | U8.24 67.5,30.5 C26.2 65.35,29 v65,29 | R21.1 v58,48
  Bottom 0.305: R12.2 R11.2 47.85,18.85 48,19 | U1.48 50.75,46.9 v51.15,47.3 C3.1 | U1.19 38.1,37.25 C7.1 | C4.1 v54.25,35.9 53.9,36.25 U1.64 | v52,33 50.85,34.15 U1.1 | J2.14 14.5,43.25 15.1,42.65 24.8,42.65 26,43.85 R23.2 30.1,43.85 v30.25,44 | U1.32 41.15,43.85 | U1.13 v44.75,32.85 | 26.09,26.09 U6.P5 26.5,24 | v47.4,21 v48,21 v48.6,21 | v65,29 R25.1 66.15,28 R24.1
  Bottom 0.406: 43.6,14.75 U2.4 | 39.9,45 C2.1 | 41.15,43.85 v40,45 | 28,33 v27,34 25.93,35.08 U4.20
  Bottom 0.813: v38.5,36 38,36 | 38,36 37.85,36 C7.1 | C1.1 37.85,35.95 38,35.95 38,36 | LED4.A LED3.A LED2.A LED1.A v30.25,51.95 | C8.1 C11.1 44.75,31.85 v44.75,32.85 | DISPLAY.P$2 76.24,56.15 C21.1 72.15,56.15 v72,56 | v27,24 27,20 20,13 19,13 C20.1 18.85,13 16,13 15.72,13.28 DISPLAY.P$22 | v27,24 C23.2 | 26.5,24 v27,24 | v72,51 72.15,50.85 R15.1
  Bottom 1.016: 43.6,14.75 46,14.75 48,14.75 C18.1
  Bottom 2.184: 48,14.75 48,19 v48,21
+5V  (via drill 0.35)
  Top 0.813: v43.25,6.75 39.55,6.75 v35.9,10.4
  Bottom 0.254: R13.2 69.85,12.35 69.5,12 65.75,12 | U3.6 61.21,14.56 61,14.35 61,12 62,11 65.75,11 | 65.75,13.4 U3.4
  Bottom 0.305: R13.2 R14.2 | U6.P3 30.36,27.36 30,27 30,24.15 C25.2
  Bottom 0.406: U3.4 65.7,13.64 65.7,13.5 | 81.3,26.75 J1.14
  Bottom 0.813: C25.2 31.15,19.75 35.9,15 v35.9,10.4 | J1.1 84.75,46.25 85,46 85,26.75 | 85,26.75 85,23 83,21 83,12 77.75,6.75 66,6.75 | J1.14 85,26.75 | 66,6.75 v43.25,6.75 | C19.1 65.75,7 66,6.75
  Bottom 1.016: 65.75,13.4 65.75,12 65.75,11 C19.1
ADC1_IN4
  Bottom 0.254: J2.15 14.75,44.75 15,45 33,45 34,46 41,46 43,44 43,38.4 42.35,37.75 U1.20
CAN1_RX
  Bottom 0.254: U1.61 44.5,37.75 32.84,26.09 U6.P4
  Bottom 0.305: 32.09,26.09 U6.P4
CAN1_TX  (via drill 0.35)
  Top 0.305: v37.75,29.9 v35.7,29.9
  Bottom 0.254: U1.62 45.1,37.25 v37.75,29.9
  Bottom 0.305: U6.P1 v35.7,29.9
CAN_HIGH
  Bottom 0.254: D3.2 20.65,27.35 19.75,28.25 L1.4 18.23,27.6 15.3,27.6 14.65,28.25 J2.4 14.6,28.25
CAN_LOW
  Bottom 0.254: J2.3 14.75,26.75 15.15,27.15 16.75,27.15 18.15,25.75 L1.3 18.88,24.4 D3.1
DISPLAY_RESET
  Bottom 0.254: 73,49 66,49 65,48 65,44 64.25,43.25 U1.50 | 73,49 76.65,49 DISPLAY.P$5 | R15.2 73.15,49.15 73,49
EDIP_DATA_READY  (via drill 0.36)
  Top 0.254: v39,29 v39,34
  Bottom 0.254: DISPLAY.P$20 76.13,10.87 73,14 73,19 69,23 45,23 v39,29 | v39,34 39,35 40.25,36.25 U1.17
EDIP_WRITE_PROTECTION  (via drill 0.36)
  Top 0.254: v58.25,40.25 59,39.5 v59,38
  Bottom 0.254: U1.56 v58.25,40.25 | DISPLAY.P$19 75.59,13.41 74,15 74,19 69,24 63,24 59,28 v59,38
EN_+5V  (via drill 0.35, 0.36)
  Top 0.254: v58,24 59,23 59,17.65 60.6,16.05 v60.6,15
  Bottom 0.254: U3.7 61.04,15.44 v60.6,15 | U1.8 47.25,32.25 45.5,30.5 45.5,25.5 47,24 v58,24
ENTER
  Bottom 0.254: J2.12 16,40.25 16.95,39.3 16.95,38.55 17.18,38.33 U4.6
GND  (via drill 0.35)
  Bottom 0.254: 56.45,36.75 56.85,36.35
  Bottom 0.305: U1.63 56.45,36.75 | 56.85,36.35 C4.2
  other vias: 11,47.3 12,47.3 13,47.3 58,36 28.85,60.25 45,36 38,33 46.25,26.25 20,16 23,3 15,3 9,8 4,17 4,25 4,34 4,42 4,52 6,62 11,65 24,65 74,65 86,65 86,59 86,54 93,62 96,53 96,49 96,19 93,8 87,11 86.95,17.95 87,3 69,8 74,23 57,12 45,43 49,43 61,45 67,45 67,48 67,51 68,58 61,56 55,56 47,55 40,48 33,48 26,48 20,47 23.5,57 23,40 19,31 35,32 44,25 46,20 56,20 65,26 57,16 46,17 47,10 49,10 61,10 61,8 29,30 29,28 71,29 72,35 34,43 50,17 64,18 63,18 64,19 63,19 39.55,14 39.55,13 39.55,12 28,20 35,20 20,20 45,11.55 45,12.55 45,13.55 63,12 64,12 75,8 70,2 79,2 65,21 32,68 37,56.55 28.5,57 71,26 23,36 70,35 61,40 61,36 20,44 27.25,39.7 74.4,28.55 21,40 21,36 60,26 52,22 42,53 45,39 49,39 25,53 62,12 9,25 9,30 9,31 9,36 9,37 9,42 9,43 9,46 9,47 11,68 29.5,68 86.95,27 86.95,45 87,35 9,24 70,33 72,33 67,41 74.75,35.35 39,25 79,23 55,51 64,2 55,2 45,2 33,2 66,65 54,65 41,65 96,27 96,42
  pour Top (isolate 0.254): 102,72 102,-2 -2,-2 -2,72
  pour Bottom (rank 6): 101,71 -1,71 -1,-1 101,-1
I2C1_SCL
  Bottom 0.254: U1.58 54.05,39.25 54.3,39.5 60.2,39.5 66.25,33.45 67.9,33.45 68.78,32.57 U8.22 68.78,27 R24.2
I2C1_SDA
  Bottom 0.254: U1.59 54.25,38.75 54.5,39 60,39 66,33 67.6,33 68.14,32.46 U8.23 68.14,29 R25.2
LED_0
  Bottom 0.254: U1.33 43.25,46.55 40.8,49 R4.1
LED_1
  Bottom 0.254: R5.1 39.8,51 43.75,47.05 U1.34
LED_2
  Bottom 0.254: U1.35 44.25,47.45 38.7,53 R6.1
LED_3
  Bottom 0.254: U1.36 44.75,47.95 37.7,55 R7.1
LED_OIL
  Bottom 0.406: J1.2 R26.1
LED_RPM0
  Bottom 0.406: J1.3 R27.1
LED_RPM1
  Bottom 0.406: J1.4 R28.1
LED_RPM2
  Bottom 0.406: J1.5 R29.1
LED_RPM3
  Bottom 0.406: J1.6 R30.1
LED_RPM4
  Bottom 0.406: J1.7 R31.1
LED_RPM5
  Bottom 0.406: J1.8 R33.1
LED_RPM6
  Bottom 0.406: J1.9 R32.1
LED_RPM7
  Bottom 0.406: J1.10 R34.1
LED_RPM8
  Bottom 0.406: J1.11 R35.1
LED_RPM9
  Bottom 0.406: J1.12 R36.1
LED_WATER
  Bottom 0.406: J1.13 R37.1
MAX_ENTER
  Bottom 0.254: U1.28 39.35,41.75 37.9,40.3 30.1,40.3 28.12,38.33 U4.15
MAX_MINUS
  Bottom 0.254: U1.25 40.25,40.25 38.7,38.7 30.9,38.7 28.57,36.38 U4.18
MAX_PLUS
  Bottom 0.254: U1.27 39.65,41.25 38.2,39.8 30.4,39.8 28.27,37.67 U4.16
MAX_SHIFT_DOWN
  Bottom 0.254: U1.24 40.4,39.75 38.75,38.1 31.15,38.1 28.77,35.73 U4.19
MAX_SHIFT_UP
  Bottom 0.254: U1.26 39.9,40.75 38.4,39.25 30.7,39.25 28.48,37.02 U4.17
MINUS
  Bottom 0.254: J2.8 14.25,34.25 15,35 16.2,35 17.57,36.38 U4.3
N$1
  Bottom 0.305: U1.47 50.25,48.4 C9.1
N$2
  Bottom 0.305: C12.1 38.1,43.25 U1.31
N$3
  Bottom 0.254: R2.1 50,31 48.25,32.75 U1.6
N$4
  Bottom 0.254: 48.75,33.25 49,33 50,33 51.5,31.5 C10.1 53.15,30.43 Q1.3 53.92,29.93 54,30 54,29.38 53.85,29.23
  Bottom 0.305: U1.5 48.75,33.25
N$5
  Bottom 0.254: R7.2 LED4.C
N$6
  Bottom 0.254: U1.60 54.9,38.25 R3.1
N$7
  Bottom 0.254: U8.4 69.41,38.36 76,44.95 77.95,44.95 R26.2
N$8  (via drill 0.35)
  Top 0.254: DISPLAY.P$8 74.03,44 v74,44
  Bottom 0.254: v74,44 R18.2
N$9
  Bottom 0.254: R27.2 77.75,42.85 74.6,42.85 70.05,38.3 U8.5
N$10  (via drill 0.35)
  Top 0.254: DISPLAY.P$7 75.07,45.5 v74,45.5
  Bottom 0.254: v74,45.5 R17.2
N$11
  Bottom 0.254: R5.2 LED2.C
N$12
  Bottom 0.254: R6.2 LED3.C
N$13
  Bottom 0.254: DISPLAY.P$6 76.11,47 R16.2
N$14
  Bottom 0.254: T1.3 27.95,14.62 | 27.95,14.62 D1.A | 25.95,14.62 27.95,14.62
  Bottom 0.406: R8.2 25.95,14.62
N$15
  Bottom 0.254: R28.2 77.55,42.35 74.85,42.35 70.68,38.18 U8.6
N$16
  Bottom 0.254: R29.2 78.05,40.35 73.6,40.35 71.32,38.07 U8.7
N$17
  Bottom 0.254: R30.2 77.05,39.85 73.95,39.85 71.95,37.85 U8.8
N$18
  Bottom 0.254: U8.9 72.59,37.89 73.2,38.5 74.95,38.5 76,37.45 77.65,37.45 77.85,37.25 R31.2
N$19
  Bottom 0.254: U8.11 73.86,35.09 74.3,34.65 75.75,34.65 75.9,34.8 77.6,34.8 R32.2
N$20
  Bottom 0.254: R33.2 77.65,35.25 76,35.25 75.35,35.9 75.35,37.45 74.85,37.95 73.45,37.95 73.22,37.72 U8.10
N$21
  Bottom 0.254: U8.13 74.49,32.34 74.75,32.6 78,32.6 R34.2
N$22
  Bottom 0.254: R35.2 77,30.1 74.1,30.1 73.86,30.34 U8.14
N$23
  Bottom 0.254: U8.15 73.22,30.13 73.7,29.65 78.05,29.65 R36.2
N$24
  Bottom 0.254: C6.1 52.15,26.77 52.08,26.85 Q1.1 50.8,27.35 R2.2
N$25
  Bottom 0.254: R37.2 78.1,28.25 77.25,27.4 74.25,27.4 72.59,29.06 U8.16
N$27
  Bottom 0.254: R4.2 LED1.C
N$38
  Bottom 0.254: U2.1 38.7,14.75 38,15.45 C16.1
N$39
  Bottom 0.254: U3.1 65.75,18.45 66.3,19 C17.1
N$40
  Bottom 0.254: U3.3 66.44,14.56 68,13
  Bottom 0.305: 68,13 R13.1
N$41
  Bottom 0.254: U2.3 42.44,15.44 44,17
  Bottom 0.305: 44,17 R11.1
N$42
  Bottom 0.254: U2.2 41.56,17.15 | R12.1 R9.2
  Bottom 0.305: 41.56,17.15 R12.1
N$43
  Bottom 0.254: U3.2 68.15,15.44 | R14.1 R10.2
  Bottom 0.305: 68.15,15.44 R14.1
N$47
  Bottom 0.254: U6.P7 23.51,28.64 L1.1
N$66
  Bottom 0.254: U6.P6 24.74,27.36 L1.2
PLUS
  Bottom 0.254: J2.11 14,38.75 15,37.75 18.45,37.75 U4.5
SHIFT_DOWN
  Bottom 0.254: J2.7 14.75,32.75 15.05,32.45 16.55,32.45 17.2,33.1 17.2,35.2 17.73,35.73 U4.2
SHIFT_UP
  Bottom 0.254: J2.10 13.15,37.25 13.2,37.3 16.9,37.3 17.18,37.02 U4.4
SWCLK  (via drill 0.35)
  Top 0.254: J3.4 91.52,33.73 v91.5,33.75
  Bottom 0.254: U1.49 56.75,43.75 57,44 57,50 57.85,50.85 R21.2 58,52 59,53 88,53 90,51 90,35.25 v91.5,33.75
SWDIO  (via drill 0.35)
  Top 0.254: v60,52 v51,52 | J3.2 91.79,32.46 v91.5,32.5
  Bottom 0.254: 68.5,52 74,52 76.04,49.96 77.09,49.96 79.05,48 85,48 86,47 86,34.5 88,32.5 v91.5,32.5 | 68.5,52 v60,52 | v51,52 50,52 49.75,51.75 U1.46 | R22.2 68.5,50.85 68.5,52
SWO  (via drill 0.35)
  Top 0.254: v91.5,35 J3.6
  Top 0.305: v56,41 v56,45
  Bottom 0.254: U1.55 55.75,40.75 v56,41 | v56,45 56,52 58,54 68,54 | 68,54 74,54 75.25,55.25 87.75,55.25 91,52 91,35.5 v91.5,35 | R20.2 68.5,54 68,54
UART4_RX
  Bottom 0.254: U1.52 59.75,42.25 68.27,33.73 DISPLAY.P$11
UART4_TX  (via drill 0.35)
  Top 0.254: DISPLAY.P$10 70.73,36.27 v68,39
  Bottom 0.254: U1.51 60,42.75 63.75,39 v68,39
USB_DM
  Bottom 0.254: U5.4 27.85,62.25 | 27.9,62.2 29.7,62.2 29.95,62.45 K1.D-
  Bottom 0.305: 27.85,62.25 27.9,62.2
USB_DP
  Bottom 0.254: K1.D+ 29.3,63.1 U5.6
USB_OTG_FS_DM
  Bottom 0.254: U1.44 48.75,49.25 38.85,59.15 28.8,59.15 27.85,60.1 U5.3
USB_OTG_FS_DP
  Bottom 0.254: U1.45 49.25,49.65 39,59.9 30.3,59.9 U5.1
USB_OTG_FS_ID
  Bottom 0.254: U1.43 48.25,48.9 38.95,58.2 27.3,58.2 26.5,59 26.5,63 27.95,64.45 28.45,64.45 28.65,64.65 K1.ID
USB_OTG_FS_VBUS  (via drill 0.35)
  Top 0.254: v31.5,57.55 v31.5,61
  Bottom 0.254: U1.42 47.75,48.45 38.7,57.5 31.55,57.5 v31.5,57.55 | v31.5,61 30.6,61.9 K1.VCC
V_IN
  pour Bottom (isolate 0.254, rank 2, no thermals): 10.35,24.2 13.65,24.2 13.65,10.35 15,9 25.7,9 25.7,10.8 27.45,10.8 27.5,7 13,7 10.35,9.65
VCC
  pour Bottom (isolate 0.254, no thermals): 62.75,15.75 62.75,16.55 59,16.55 58.5,16.05 58.5,9.25 41.8,9.2 41.8,11.7 40.45,11.7 40.45,9.2 32,9 32,12 30.05,12 30,11.95 30,9.2 27.65,9.25 27.65,7 28.8,7 29.5,7.7 59.95,7.7 60,7.65 60,15.7

### Text on the board
Konstruktion: top